# Altium schematic sheet Precharge_M2019_V1.1.SchDoc: Precharge_M2019_V1.1
size 270 x 207 mm; Date: 1/4/2019 10:42:01 PM; SheetNumber: 1; GateName_1: G$1; SymbolName_1: LETTER_L; LibraryName: frames; DeviceSetName: LETTER_L; GateName_2: G$2; SymbolName_2: DOCFIELD
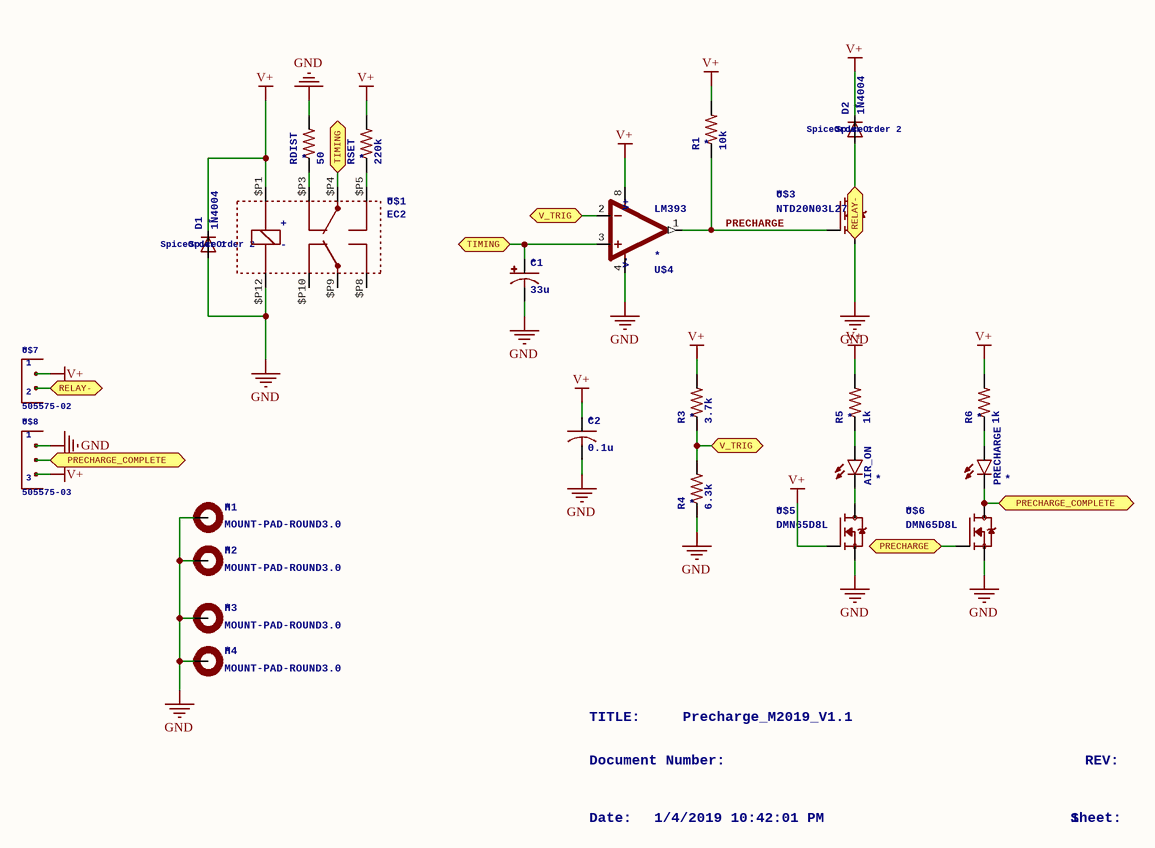
[diagram p0: Precharge_M2019_V1.1.SchDoc]

## Parts
AIR_ON  LED0603  [LED-0603]  (value not drawn)
C1  33u  [E2,5-5]
C2  0.1u  [C0805]
D1  1N4004  SpiceOrder1: SpiceOrder 1  SpiceOrder2: SpiceOrder 2  [DO41-10]
D2  1N4004  SpiceOrder1: SpiceOrder 1  SpiceOrder2: SpiceOrder 2  [DO41-10]
H1  MOUNT-PAD-ROUND3.0  [3,0-PAD]
H2  MOUNT-PAD-ROUND3.0  [3,0-PAD]
H3  MOUNT-PAD-ROUND3.0  [3,0-PAD]
H4  MOUNT-PAD-ROUND3.0  [3,0-PAD]
PRECHARGE  LED0603  [LED-0603]  (value not drawn)
R1  10k  [R0805]
R3  3.7k  [R0805]
R4  6.3k  [R0805]
R5  1k  [R0805]
R6  1k  [R0805]
RDIST  50  [AXIAL-0.5]
RSET  220k  [0207/10]
U$1  EC2  [DPDT_2.54]
U$3  NTD20N03L27  [DPACK]
U$4  LM393  [SO08]
U$5  DMN65D8L  [SOT23]
U$6  DMN65D8L  [SOT23]
U$7  505575-02  [505575-02]
U$8  505575-03  [505575-03]

## Ports
PRECHARGE, PRECHARGE_COMPLETE, RELAY-, TIMING, V_TRIG

## Nets
GND: C1.- C2.2 D1.A H1.B3,0(MOUNT) H2.B3,0(MOUNT) H3.B3,0(MOUNT) H4.B3,0(MOUNT) R4.1 RDIST.P$2 U$1.$P12 U$3.3(S) U$4.4(V-) U$5.2(S) U$6.2(S) U$8.1
V+: C2.1 D1.C D2.C R1.2 R3.2 R5.2 R6.2 RSET.2 U$1.$P1 U$4.8(V+) U$5.1(G) U$7.1 U$8.3
PRECHARGE: R1.1 U$3.1(G) U$4.1(OUT)
PRECHARGE: U$6.1(G) ; port PRECHARGE  [a separate net that carries the same name]
PRECHARGE_COMPLETE: PRECHARGE.C U$6.3(D) U$8.2 ; port PRECHARGE_COMPLETE
RELAY-: D2.A U$3.2(D) U$7.2 ; port RELAY-
TIMING: C1.+ U$1.$P4 U$4.3(+IN) ; port TIMING
V_TRIG: R3.1 R4.2 U$4.2(-IN) ; port V_TRIG
NetAIR_ON_A: AIR_ON.A R5.1
NetAIR_ON_C: AIR_ON.C U$5.3(D)
NetPRECHARGE_A: PRECHARGE.A R6.1
NetRDIST_P$1: RDIST.P$1 U$1.$P3
NetRSET_1: RSET.1 U$1.$P5

Not connected (* = marked no-connect by the designer): U$1 $P8 $P9 $P10

## Notes on the sheet
- TITLE:
- Document Number:
- Precharge_M2019_V1.1
- REV:
- Date:
- 1/4/2019 10:42:01 PM
- Sheet:
- 1

## Library data of the parts
AIR_ON PRECHARGE = LED0603: LEDsStandard schematic elements and footprints for 5mm, 3mm, 1206, and 0603 sized LEDs. 5mm - Spark Fun Electronics SKU : COM-00529 (and others); GateName_1: G$1; SymbolName_1: LED; DeviceName: 0603; LibraryName: SparkFun-LED; DeviceSetName: LED; NAME: *
C1 = CPOL-USE2.5-5: POLARIZED CAPACITOR, American symbol; GateName_1: G$1; DeviceName: E2.5-5; SymbolName_1: CPOL-US; LibraryName: rcl; DeviceSetName: CPOL-US; NAME: *; SPICEPREFIX: C
C2 = C-USC0805: CAPACITOR, American symbol; GateName_1: G$1; SymbolName_1: C-US-1; DeviceSetName: C-US; DeviceName: C0805; LibraryName: resistor; NAME: *
D1 D2 = 1N4004: DIODEgeneral purpose rectifier, 1 A; GateName_1: 1; SymbolName_1: D; LibraryName: Diodes_IFE; DeviceSetName: 1N4004; NAME: *
H1-H4 = MOUNT-PAD-ROUND3.0: MOUNTING PAD, round; GateName_1: G$1; DeviceName: 3.0; SymbolName_1: MOUNT-PAD; LibraryName: holes; DeviceSetName: MOUNT-PAD-ROUND; NAME: *
R1 R3-R6 = R-US_R0805: RESISTOR, American symbol; GateName_1: G$1; SymbolName_1: R-US; DeviceSetName: R-US_; DeviceName: R0805; LibraryName: rcl; NAME: *; SPICEPREFIX: R
RDIST = RESISTORPTH-1/2W: ResistorBasic schematic elements and footprints for 0603, 1206, and PTH resistors.; GateName_1: G$1; SymbolName_1: RESISTOR; DeviceName: PTH-1/2W; LibraryName: SparkFun-Resistors; DeviceSetName: RESISTOR; NAME: *
RSET = R-US_0207/10: RESISTOR, American symbol; GateName_1: G$1; SymbolName_1: R-US; DeviceSetName: R-US_; DeviceName: 0207/10; LibraryName: rcl; NAME: *; SPICEPREFIX: R
U$1 = EC2: KEMET EC2 DPDT General Purpose 2A Relay. 12V coil voltage.Datasheet Digikey; GateName_1: G$1; SymbolName_1: MONOSTABLERELAY; LibraryName: KEMET; DeviceSetName: EC2; NAME: *; +: +; -: -
U$3 = NTD20N03L27: ON-Semi 30V 20A Mosfet https://media.digikey.com/pdf/Data%20Sheets/ON%20Semiconductor%20PDFs/NTD20N03L27,NVD20N03L27.pdf; GateName_1: G$1; SymbolName_1: N-MOSFET; LibraryName: Display_Custom; DeviceSetName: NTD20N03L27; NAME: *
U$4 = LM393: Low-voltage comparator; GateName_1: G1; SymbolName_1: OP-AMP+-; LibraryName: SparkFun-AnalogIC; DeviceSetName: LM393; NAME: *; V+: V+; V-: V-
U$5 U$6 = DMN65D8L: 60V N-Channel Mosfet SOT23 https://www.diodes.com/assets/Datasheets/DMN65D8L.pdf; GateName_1: G$1; SymbolName_1: N-MOSFET; LibraryName: Display_Custom; DeviceSetName: DMN65D8L; NAME: *
U$7 = 505575-02: Molex 505575-02 2 Position 2.00mm pitch connector wire to board connector Datasheet; GateName_1: G$1; SymbolName_1: 2POS; LibraryName: MOLEX; DeviceSetName: 505575-02; NAME: *; 1: 1; 2: 2
U$8 = 505575-03: Molex 505575-03 3 Position 2.00mm pitch connector wire to board connector Datasheet; GateName_1: G$1; SymbolName_1: 3POS; LibraryName: MOLEX; DeviceSetName: 505575-03; NAME: *; 1: 1; 3: 3